# Altium schematic sheet version1.SchDoc
size A portrait; SheetNumber: 1; SheetTotal: 1
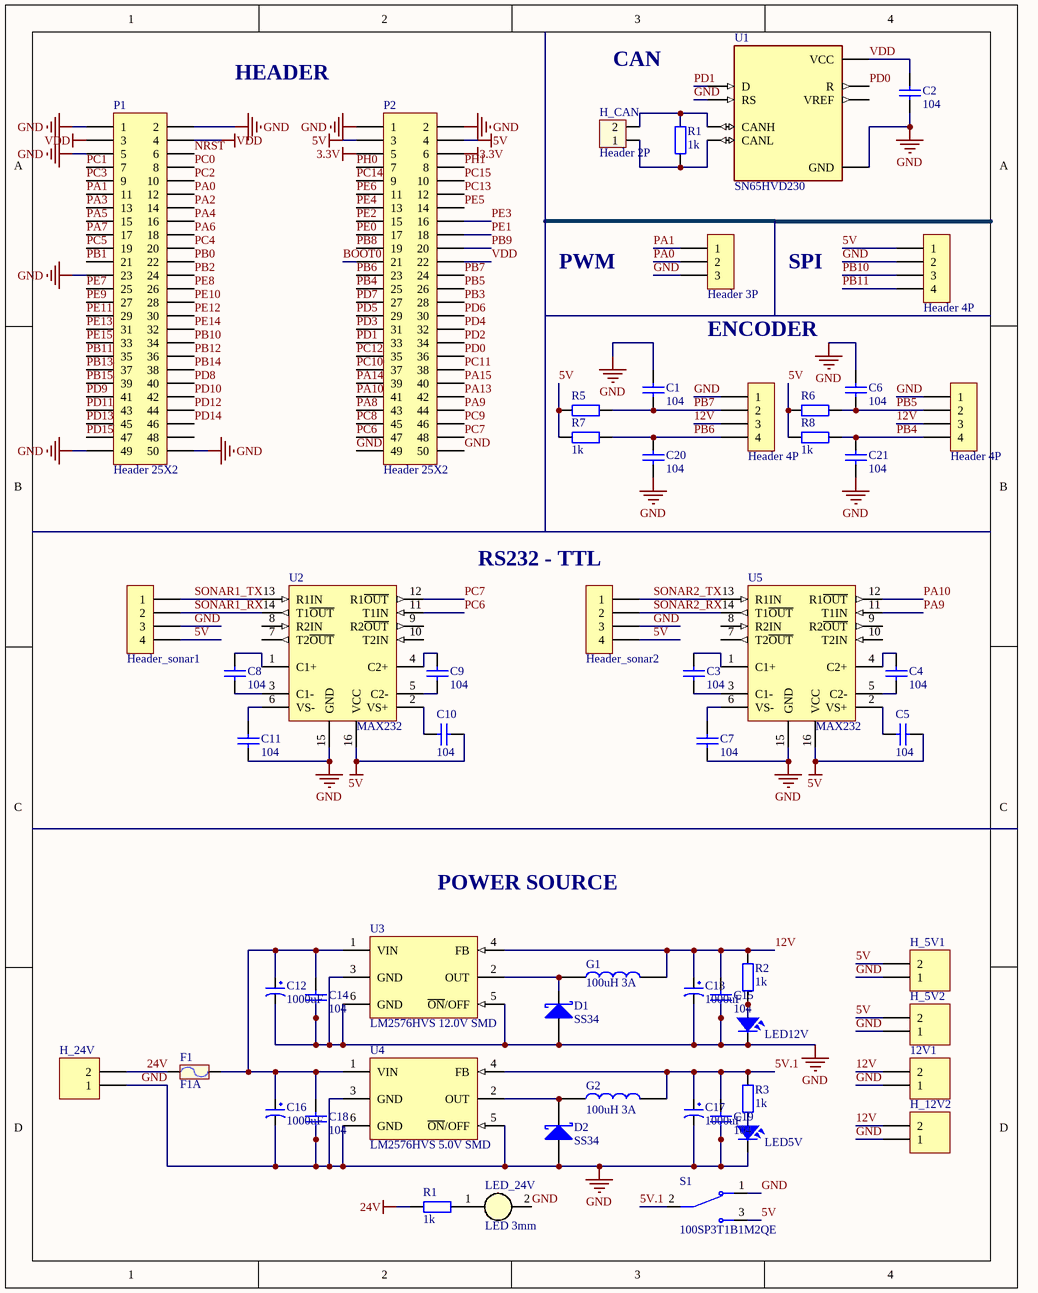
[diagram p0: version1.SchDoc]

## Parts
(Parts that share a designator on the sheet are numbered #1, #2 ... from top to bottom, then left to right.)
12V1  Header 2  [HED2]  (value not drawn)
C1  104  [tu 0805]
C2  104  [tu 0805]
C3  104  [tu 0805]
C4  104  [tu 0805]
C5  104  [tu 0805]
C6  104  [tu 0805]
C7  104  [tu 0805]
C8  104  [tu 0805]
C9  104  [tu 0805]
C10  104  [tu 0805]
C11  104  [tu 0805]
C12  1000uF  [tu hoa 10mm]
C13  1000uF  [tu hoa 10mm]
C14  104  [tu 0805]
C15  104  [tu 0805]
C16  1000uF  [tu hoa 10mm]
C17  1000uF  [tu hoa 10mm]
C18  104  [tu 0805]
C19  104  [tu 0805]
C20  104  [tu 0805]
C21  104  [tu 0805]
D1  SS34  [DIODE_DO214AC_SMA]
D2  SS34  [DIODE_DO214AC_SMA]
F1  F1A  [Fuse]
G1  100uH 3A  [CUON CAM 100uH3A]
G2  100uH 3A  [CUON CAM 100uH3A]
H_5V1  Header 2  [HED2]  (value not drawn)
H_5V2  Header 2  [HED2]  (value not drawn)
H_12V2  Header 2  [HED2]  (value not drawn)
H_24V  Header 2  [HED2]  (value not drawn)
H_CAN  Header 2P  [XH2.54M-2]
H_ENC1  Header 4P  [XH2.54M-4]
H_ENC2  Header 4P  [XH2.54M-4]
H_PWM  Header 3P  [XH2.54M-3]
H_SPI  Header 4P  [XH2.54M-4]
Header_sonar1  Header_sonar1  [XH2.54M-4]
Header_sonar2  Header_sonar2  [XH2.54M-4]
LED5V  LED  [LED-0805-Green]  (value not drawn)
LED12V  LED  [LED-0805-Green]  (value not drawn)
LED_24V  LED 3mm  [LED-3MM-WHITE]
P1  Header 25X2  [HDR2X25]
P2  Header 25X2  [HDR2X25]
R1#1  1k  [tro smd 0805]
R1#2  1k  [tro vach 1/2w]
R2  1k  [tro smd 0805]
R3  1k  [tro smd 0805]
R5  1k  [tro smd 0805]  (value not drawn)
R6  1k  [tro smd 0805]  (value not drawn)
R7  1k  [tro smd 0805]
R8  1k  [tro smd 0805]
S1  100SP3T1B1M2QE  [SW_100SP3T1B1M2QE]
U1  SN65HVD230  [SOIC127P599X175-8N]
U2  MAX232  [SO16]
U3  LM2576HVS 12.0V SMD  [TO263-5]
U4  LM2576HVS 5.0V SMD  [TO263-5]
U5  MAX232  [SO16]

## Nets
3.3V: P2.5 P2.6
5V: C5.2 C10.2 H_5V1.2 H_5V2.2 H_SPI.1 Header_sonar1.4 Header_sonar2.4 P2.3 P2.4 R5.1 R6.1 R7.1 R8.1 S1.3 U2.16(VCC) U5.16(VCC)
24V: F1.1 H_24V.2 R1#2.1
GND: 12V1.1 C1.1 C2.2 C6.1 C7.2 C11.2 C12.2 C13.2 C14.2 C15.2 C16.2 C17.2 C18.2 C19.2 C20.2 C21.2 D1.1(A) D2.1(A) H_5V1.1 H_5V2.1 H_12V2.1 H_24V.1 H_ENC1.1 H_ENC2.1 H_PWM.3 H_SPI.2 Header_sonar1.3 Header_sonar2.3 LED5V.2 LED12V.2 LED_24V.2(K) P1.1 P1.2 P1.5 P1.23 P1.49 P1.50 P2.1 P2.2 P2.49 P2.50 S1.1 U1.2(GND) U1.8(RS) U2.15(GND) U3.3(GND) U3.5(~{ON}/OFF) U3.6(GND) U4.3(GND) U4.5(~{ON}/OFF) U4.6(GND) U5.15(GND)
VDD: C2.1 P1.3 P1.4 P2.22 U1.3(VCC)
5V.1: C17.1 C19.1 G2.2 R3.2 S1.2 U4.4(FB)
12V: 12V1.2 C13.1 C15.1 G1.2 H_12V2.2 H_ENC1.3 H_ENC2.3 R2.2 U3.4(FB)
BOOT0: P2.21
NRST: P1.6
PA0: H_PWM.2 P1.12
PA1: H_PWM.1 P1.11
PA2: P1.14
PA3: P1.13
PA4: P1.16
PA5: P1.15
PA6: P1.18
PA7: P1.17
PA8: P2.43
PA9: P2.44 U5.11(T1IN)
PA10: P2.41 U5.12(R1~{OUT})
PA13: P2.42
PA14: P2.39
PA15: P2.40
PB0: P1.22
PB1: P1.21
PB2: P1.24
PB3: P2.28
PB4: C21.1 H_ENC2.4 P2.25 R8.2
PB5: C6.2 H_ENC2.2 P2.26 R6.2
PB6: C20.1 H_ENC1.4 P2.23 R7.2
PB7: C1.2 H_ENC1.2 P2.24 R5.2
PB8: P2.19
PB9: P2.20
PB10: H_SPI.3 P1.34
PB11: H_SPI.4 P1.35
PB12: P1.36
PB13: P1.37
PB14: P1.38
PB15: P1.39
PC0: P1.8
PC1: P1.7
PC2: P1.10
PC3: P1.9
PC4: P1.20
PC5: P1.19
PC6: P2.47 U2.11(T1IN)
PC7: P2.48 U2.12(R1~{OUT})
PC8: P2.45
PC9: P2.46
PC10: P2.37
PC11: P2.38
PC12: P2.35
PC13: P2.12
PC14: P2.9
PC15: P2.10
PD0: P2.36 U1.4(R)
PD1: P2.33 U1.1(D)
PD2: P2.34
PD3: P2.31
PD4: P2.32
PD5: P2.29
PD6: P2.30
PD7: P2.27
PD8: P1.40
PD9: P1.41
PD10: P1.42
PD11: P1.43
PD12: P1.44
PD13: P1.45
PD14: P1.46
PD15: P1.47
PE0: P2.17
PE1: P2.18
PE2: P2.15
PE3: P2.16
PE4: P2.13
PE5: P2.14
PE6: P2.11
PE7: P1.25
PE8: P1.26
PE9: P1.27
PE10: P1.28
PE11: P1.29
PE12: P1.30
PE13: P1.31
PE14: P1.32
PE15: P1.33
PH0: P2.7
PH1: P2.8
SONAR1_RX: Header_sonar1.2 U2.14(T1~{OUT})
SONAR1_TX: Header_sonar1.1 U2.13(R1IN)
SONAR2_RX: Header_sonar2.2 U5.14(T1~{OUT})
SONAR2_TX: Header_sonar2.1 U5.13(R1IN)
NetC3_1: C3.1 U5.1(C1+)
NetC3_2: C3.2 U5.3(C1-)
NetC4_1: C4.1 U5.4(C2+)
NetC4_2: C4.2 U5.5(C2-)
NetC5_1: C5.1 U5.2(VS+)
NetC7_1: C7.1 U5.6(VS-)
NetC8_1: C8.1 U2.1(C1+)
NetC8_2: C8.2 U2.3(C1-)
NetC9_1: C9.1 U2.4(C2+)
NetC9_2: C9.2 U2.5(C2-)
NetC10_1: C10.1 U2.2(VS+)
NetC11_1: C11.1 U2.6(VS-)
NetC12_1: C12.1 C14.1 C16.1 C18.1 F1.2 U3.1(VIN) U4.1(VIN)
NetD1_2: D1.2(K) G1.1 U3.2(OUT)
NetD2_2: D2.2(K) G2.1 U4.2(OUT)
NetH_CAN_1: H_CAN.1 R1#1.2 U1.6(CANL)
NetH_CAN_2: H_CAN.2 R1#1.1 U1.7(CANH)
NetLED5V_1: LED5V.1 R3.1
NetLED12V_1: LED12V.1 R2.1
NetLED_24V_1: LED_24V.1(A) R1#2.2

Not connected (* = marked no-connect by the designer): P1 48; U1 5(VREF); U2 7(T2~{OUT}) 8(R2IN) 9(R2~{OUT}) 10(T2IN); U5 7(T2~{OUT}) 8(R2IN) 9(R2~{OUT}) 10(T2IN)

## Notes on the sheet
- HEADER
- CAN
- PWM
- SPI
- ENCODER
- (near Header_sonar2) RS232 - TTL
- POWER SOURCE

## Library data of the parts
12V1 H_5V1 H_5V2 H_12V2 H_24V = Header 2: Header, 2-Pin; Manufacturer: Generic Components; Class: Connector; Value: Header 2
C1 C3-C11 C20 C21 = Tu 0805 105 50V 10%: Dán; Don_Vi: Con; So_Chan: 2; Ten_Linh_Kien: Tụ 0805 105-1uF 10% 50V; Ma_Hang: MH004552; Chung_Loai: Dán; Kieu_Chan: *
C2 C14 C15 C18 C19 = Tu 0805 104 50V 10%: Dán; Don_Vi: Con; So_Chan: 2; Ten_Linh_Kien: Tụ 0805 104-100nF 10% 50V; Ma_Hang: MH004551; Chung_Loai: Dán; Kieu_Chan: *
C12 C13 C16 C17 = Tu Hoa 1000uF 10V 10x12: Cắm; So_Chan: 2; Don_Vi: Con; Ten_Linh_Kien: Tụ Hóa 1000uF 10V 10x12MM; Ma_Hang: MH006614; Kieu_Chan: *; Chung_Loai: Cắm
D1 D2 = SS34: DIODE SCHOTTKY 40V 3A SMA; Solder: SMT; MPN: SS34; Value: SS34; MFR: *
F1 = Fuse: Designed by: VanDungEvn; Value: Fuse
G1 G2 = CUON CAM 100uH DIP: Dán; Don_Vi: Con; Ma_Hang: MH002209; Ten_Linh_Kien: Cuộn Cảm 100uH 3A 8x10MM; Chung_Loai: Dán; Ghi Chu: *; Kieu Chan: *
H_CAN = Header 2P: THT; Ten_Linh_Kien: Header 2P XH2.54-2P Đực Cong; Don_Vi: Con; Ma_Hang: MH002852; Chung_Loai: Cắm
H_ENC1 H_ENC2 H_SPI Header_sonar1 Header_sonar2 = Header 4P: THT; Ten_Linh_Kien: Header 4P XH2.54-4P Đực Cong; Don_Vi: Con; Ma_Hang: MH001310; Chung_Loai: Cắm
H_PWM = Header 3P: THT; Ten_Linh_Kien: Header 3P XH2.54-3P Đực Cong; Don_Vi: Con; Ma_Hang: MH001302; Chung_Loai: Cắm
LED5V LED12V = LED SMD: Value: LED 3 - 5 ly 2 Colour
LED_24V = LED 3mm Trang: Cắm; Don_Vi: Con; Ma_Hang: MH009001; Ten_Linh_Kien: LED 3MM Trắng SS (1000c); Ghi_Chu: *; Kieu_Chan: *; Chung_Loai: Cắm
P1 P2 = Header 25X2: Header, 25-Pin, Dual row; LatestRevisionDate: 17-Jul-2002; LatestRevisionNote: Re-released for DXP Platform.; Publisher: Altium Limited
R1#1 R2 R3 R5-R8 = Tro 0805 1% 470k: Dán; Don_Vi: Con; So_Chan: 2; Ten_Linh_Kien: Trở 0805 1% 470k; Ma_Hang: MH005485; Chung_Loai: Dán; Kieu_Chan: *
R1#2 = Tro Vach 1/2W 5% 220k: Cắm; Don_Vi: Con; So_Chan: 2; Ten_Linh_Kien: Trở 5% 1/2w 220k; Ma_Hang: MH006190; Chung_Loai: Cắm; Kieu_Chan: *
S1 = 100SP3T1B1M2QE: MF: {'manufacturer': u'E-Switch'}; Availability: Unavailable; Price: None; Package: None; MP: 100SP3T1B1M2QE; Value: *
U1 = SN65HVD230: 1/1 Transceiver Half CANbus 8-SOIC; MF: Texas Instruments; Availability: Unavailable; Package: SOIC-8 Texas Instruments; SnapEDA_Link: https://www.snapeda.com/parts/SN65HVD230/Texas%20Instruments/view-part/558072/?ref=snap; MP: SN65HVD230; Price: None; Value: *
U2 U5 = MAX232: RS232 LEVEL SHIFTER; Manufacturer Part Number: MAX232DR; Manufacturer: Texas Instruments; Number of Drivers/Receivers: 2/2; Voltage - Supply: 4.5 V ~ 5.5 V; Supplier 1: Digi-Key; Supplier Part Number 1: 296-14619-1-ND; RoHS: RoHS Compliant; Packaging: Cut Tape (CT); Protocol: RS232; Type: Transceiver; Supplier Part Number: 296-14619-1-ND; Supplier: Digi-Key; Category: Integrated Circuits (ICs); Package / Case: 16-SOIC (3.9mm Width)
U3 U4 = LM2576HVS 5.0V SMD: Dán; Ten_Linh_Kien: LM2576HVS-5.0V BUCK 5V 3A TO263-5; Don_Vi: Con; Ma_Hang: MH002362; Ghi_Chu: *; Kieu_Chan: *; Chung_Loai: Dán